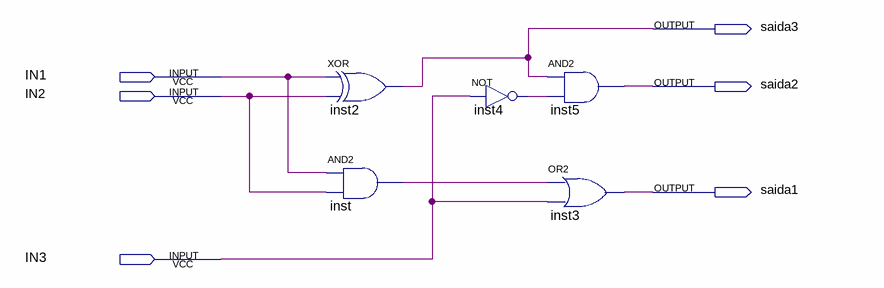
[diagram p0: schematic sheet]
// Quartus schematic diagramadeblocos.bdf as structural Verilog: 5 symbols, 6 pins
module diagramadeblocos (
  input  IN1,
  input  IN2,
  input  IN3,
  output saida3,
  output saida2,
  output saida1
);

  wire inst4_out, inst_out;

  xor inst2 (saida3, IN1, IN2);
  and inst (inst_out, IN1, IN2);
  not inst4 (inst4_out, IN3);
  and inst5 (saida2, saida3, inst4_out);
  or inst3 (saida1, inst_out, IN3);
endmodule
